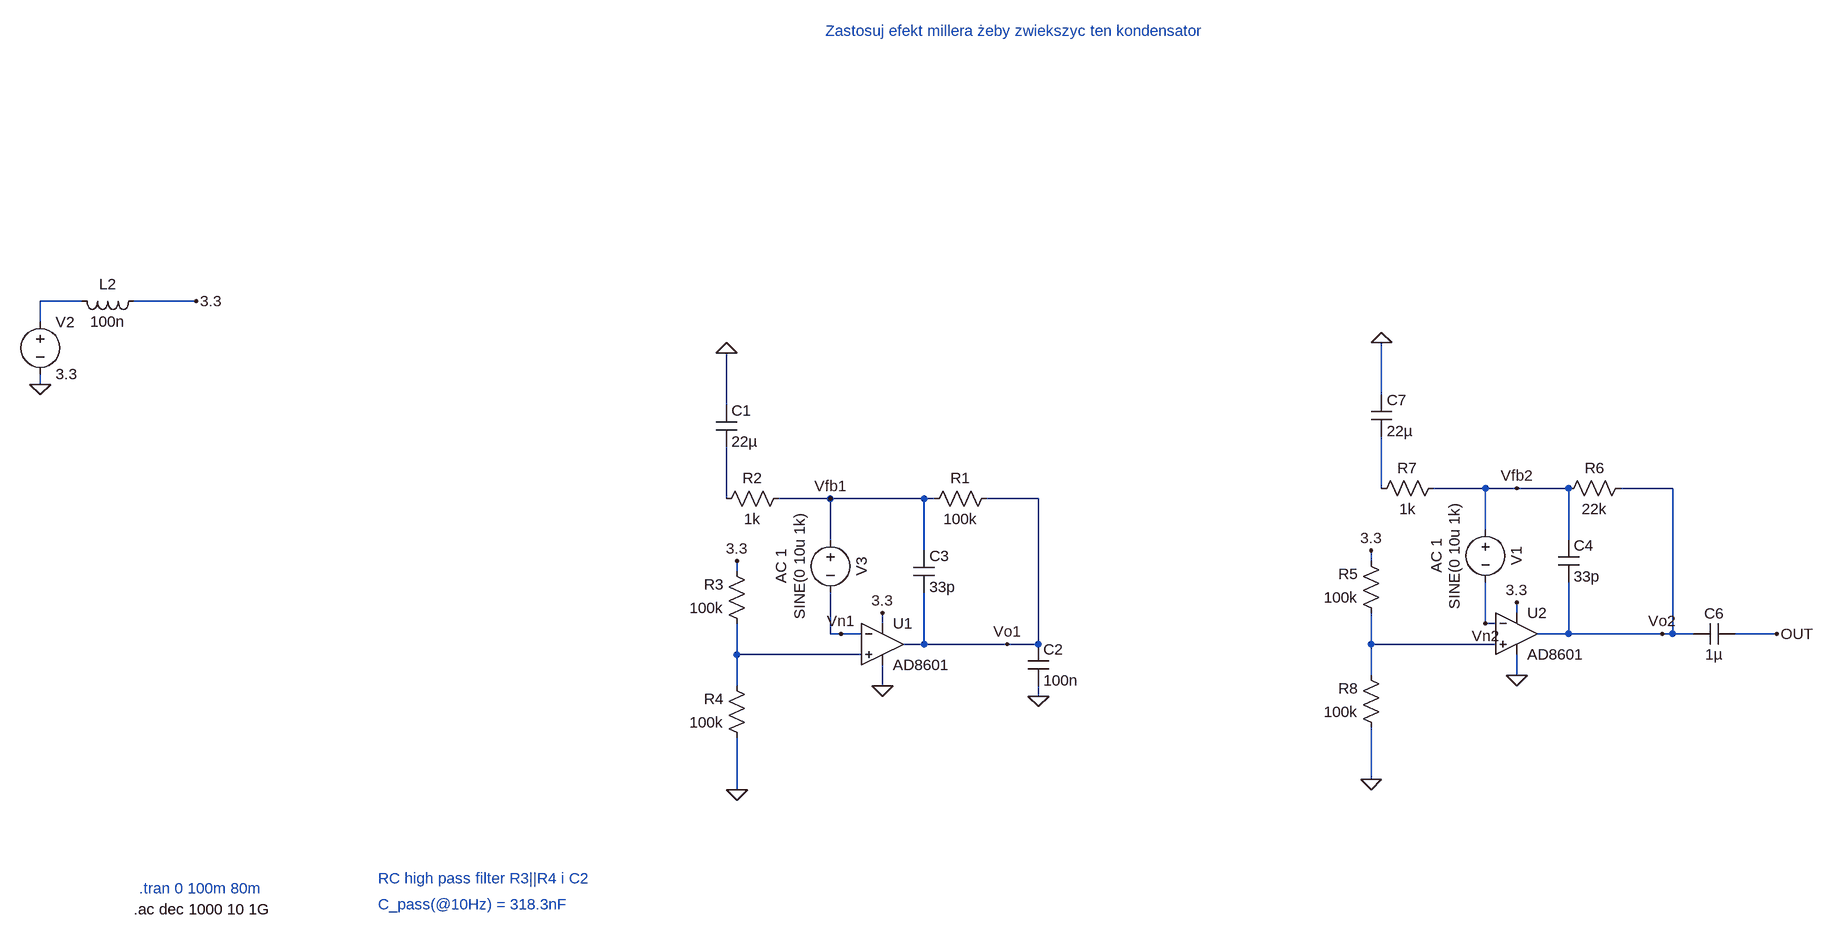
[diagram p0: schematic micAmp_cascade_stability.asc]
micAmp_cascade_stability.asc, the LTspice schematic file:
Version 4
SHEET 1 1780 680
WIRE -896 -384 -960 -384
WIRE -720 -384 -816 -384
WIRE -960 -352 -960 -384
WIRE -960 -256 -960 -272
WIRE 1104 -240 1104 -320
WIRE 96 -224 96 -304
WIRE 1104 -96 1104 -176
WIRE 1264 -96 1184 -96
WIRE 1312 -96 1264 -96
WIRE 1392 -96 1312 -96
WIRE 1552 -96 1472 -96
WIRE 96 -80 96 -160
WIRE 256 -80 176 -80
WIRE 400 -80 256 -80
WIRE 416 -80 400 -80
WIRE 576 -80 496 -80
WIRE 1264 -32 1264 -96
WIRE 256 -16 256 -80
WIRE 1392 -16 1392 -96
WIRE 400 0 400 -80
WIRE 1088 16 1088 0
WIRE 112 32 112 16
WIRE 1312 96 1312 80
WIRE 336 112 336 96
WIRE 1264 112 1264 48
WIRE 1280 112 1264 112
WIRE 256 128 256 64
WIRE 272 128 256 128
WIRE 304 128 272 128
WIRE 1392 128 1392 48
WIRE 1392 128 1344 128
WIRE 1536 128 1392 128
WIRE 1552 128 1552 -96
WIRE 1552 128 1536 128
WIRE 1584 128 1552 128
WIRE 1712 128 1648 128
WIRE 400 144 400 64
WIRE 400 144 368 144
WIRE 528 144 400 144
WIRE 576 144 576 -80
WIRE 576 144 528 144
WIRE 1088 144 1088 96
WIRE 1280 144 1088 144
WIRE 112 160 112 112
WIRE 304 160 112 160
WIRE 1088 192 1088 144
WIRE 1312 192 1312 160
WIRE 112 208 112 160
WIRE 336 208 336 176
WIRE 576 224 576 208
WIRE 1088 352 1088 272
WIRE 112 368 112 288
FLAG 112 368 0
FLAG -960 -256 0
FLAG -720 -384 3.3
FLAG 112 16 3.3
FLAG 336 96 3.3
FLAG 336 208 0
FLAG 96 -304 0
FLAG 1312 80 3.3
FLAG 1312 192 0
FLAG 1712 128 OUT
FLAG 1104 -320 0
FLAG 256 -80 Vfb1
FLAG 1312 -96 Vfb2
FLAG 272 128 Vn1
FLAG 1264 112 Vn2
FLAG 1088 352 0
FLAG 1088 0 3.3
FLAG 528 144 Vo1
FLAG 1536 128 Vo2
FLAG 576 224 0
SYMBOL OpAmps\\AD8601 336 80 R0
SYMATTR InstName U1
SYMBOL res 512 -96 R90
WINDOW 0 0 56 VBottom 2
WINDOW 3 32 56 VTop 2
SYMATTR InstName R1
SYMATTR Value 100k
SYMBOL res 192 -96 R90
WINDOW 0 0 56 VBottom 2
WINDOW 3 32 56 VTop 2
SYMATTR InstName R2
SYMATTR Value 1k
SYMBOL res 128 128 R180
WINDOW 0 36 76 Left 2
WINDOW 3 36 40 Left 2
SYMATTR InstName R3
SYMATTR Value 100k
SYMBOL res 128 304 R180
WINDOW 0 36 76 Left 2
WINDOW 3 36 40 Left 2
SYMATTR InstName R4
SYMATTR Value 100k
SYMBOL voltage -960 -368 R0
WINDOW 123 0 0 Left 0
WINDOW 39 0 0 Left 0
SYMATTR InstName V2
SYMATTR Value 3.3
SYMBOL ind -800 -400 R90
WINDOW 0 5 56 VBottom 2
WINDOW 3 32 56 VTop 2
SYMATTR InstName L2
SYMATTR Value 100n
SYMBOL voltage 256 -32 R0
WINDOW 0 32 56 VTop 2
WINDOW 3 -32 56 VBottom 2
WINDOW 123 -60 56 VBottom 2
WINDOW 39 0 0 Left 0
SYMATTR InstName V3
SYMATTR Value SINE(0 10u 1k)
SYMATTR Value2 AC 1
SYMBOL cap 80 -224 R0
SYMATTR InstName C1
SYMATTR Value 22µ
SYMBOL OpAmps\\AD8601 1312 64 R0
SYMATTR InstName U2
SYMBOL res 1488 -112 R90
WINDOW 0 0 56 VBottom 2
WINDOW 3 32 56 VTop 2
SYMATTR InstName R6
SYMATTR Value 22k
SYMBOL res 1200 -112 R90
WINDOW 0 0 56 VBottom 2
WINDOW 3 32 56 VTop 2
SYMATTR InstName R7
SYMATTR Value 1k
SYMBOL cap 1648 112 R90
WINDOW 0 0 32 VBottom 2
WINDOW 3 32 32 VTop 2
SYMATTR InstName C6
SYMATTR Value 1µ
SYMBOL cap 1088 -240 R0
SYMATTR InstName C7
SYMATTR Value 22µ
SYMBOL voltage 1264 -48 R0
WINDOW 0 32 56 VTop 2
WINDOW 3 -32 56 VBottom 2
WINDOW 123 -60 56 VBottom 2
WINDOW 39 0 0 Left 0
SYMATTR InstName V1
SYMATTR Value SINE(0 10u 1k)
SYMATTR Value2 AC 1
SYMBOL res 1104 112 R180
WINDOW 0 36 76 Left 2
WINDOW 3 36 40 Left 2
SYMATTR InstName R5
SYMATTR Value 100k
SYMBOL res 1104 288 R180
WINDOW 0 36 76 Left 2
WINDOW 3 36 40 Left 2
SYMATTR InstName R8
SYMATTR Value 100k
SYMBOL cap 560 144 R0
SYMATTR InstName C2
SYMATTR Value 100n
SYMBOL cap 384 0 R0
SYMATTR InstName C3
SYMATTR Value 33p
SYMBOL cap 1376 -16 R0
SYMATTR InstName C4
SYMATTR Value 33p
TEXT -808 520 Left 2 ;.tran 0 100m 80m
TEXT -816 552 Left 2 !.ac dec 1000 10 1G
TEXT -440 504 Left 2 ;RC high pass filter R3||R4 i C2
TEXT -440 544 Left 2 ;C_pass(@10Hz) = 318.3nF
TEXT 248 -800 Left 2 ;Zastosuj efekt millera żeby zwiekszyc ten kondensator

The netlist it stands for:
* micAmp_cascade_stability.asc
XU1 N005 Vn1 3.3 0 Vo1 AD8601  ; pins In+ In- V+ V- OUT
R1 Vo1 Vfb1 100k
R2 Vfb1 N003 1k
R3 N005 3.3 100k
R4 0 N005 100k
V2 N001 0 3.3
L2 3.3 N001 100n
V3 Vfb1 Vn1 SINE(0 10u 1k) AC 1
C1 0 N003 22µ
XU2 N004 Vn2 3.3 0 Vo2 AD8601  ; pins In+ In- V+ V- OUT
R6 Vo2 Vfb2 22k
R7 Vfb2 N002 1k
C6 OUT Vo2 1µ
C7 0 N002 22µ
V1 Vfb2 Vn2 SINE(0 10u 1k) AC 1
R5 N004 3.3 100k
R8 0 N004 100k
C2 Vo1 0 100n
C3 Vfb1 Vo1 33p
C4 Vfb2 Vo2 33p
* .tran 0 100m 80m
.ac dec 1000 10 1G
* RC high pass filter R3||R4 i C2
* C_pass(@10Hz) = 318.3nF
* Zastosuj efekt millera żeby zwiekszyc ten kondensator
.backanno
.end